# Altium schematic sheet obc-v2_EXP-CAN-RS422.SchDoc
size 420 x 297 mm; SheetNumber: 12; SheetTotal: 21
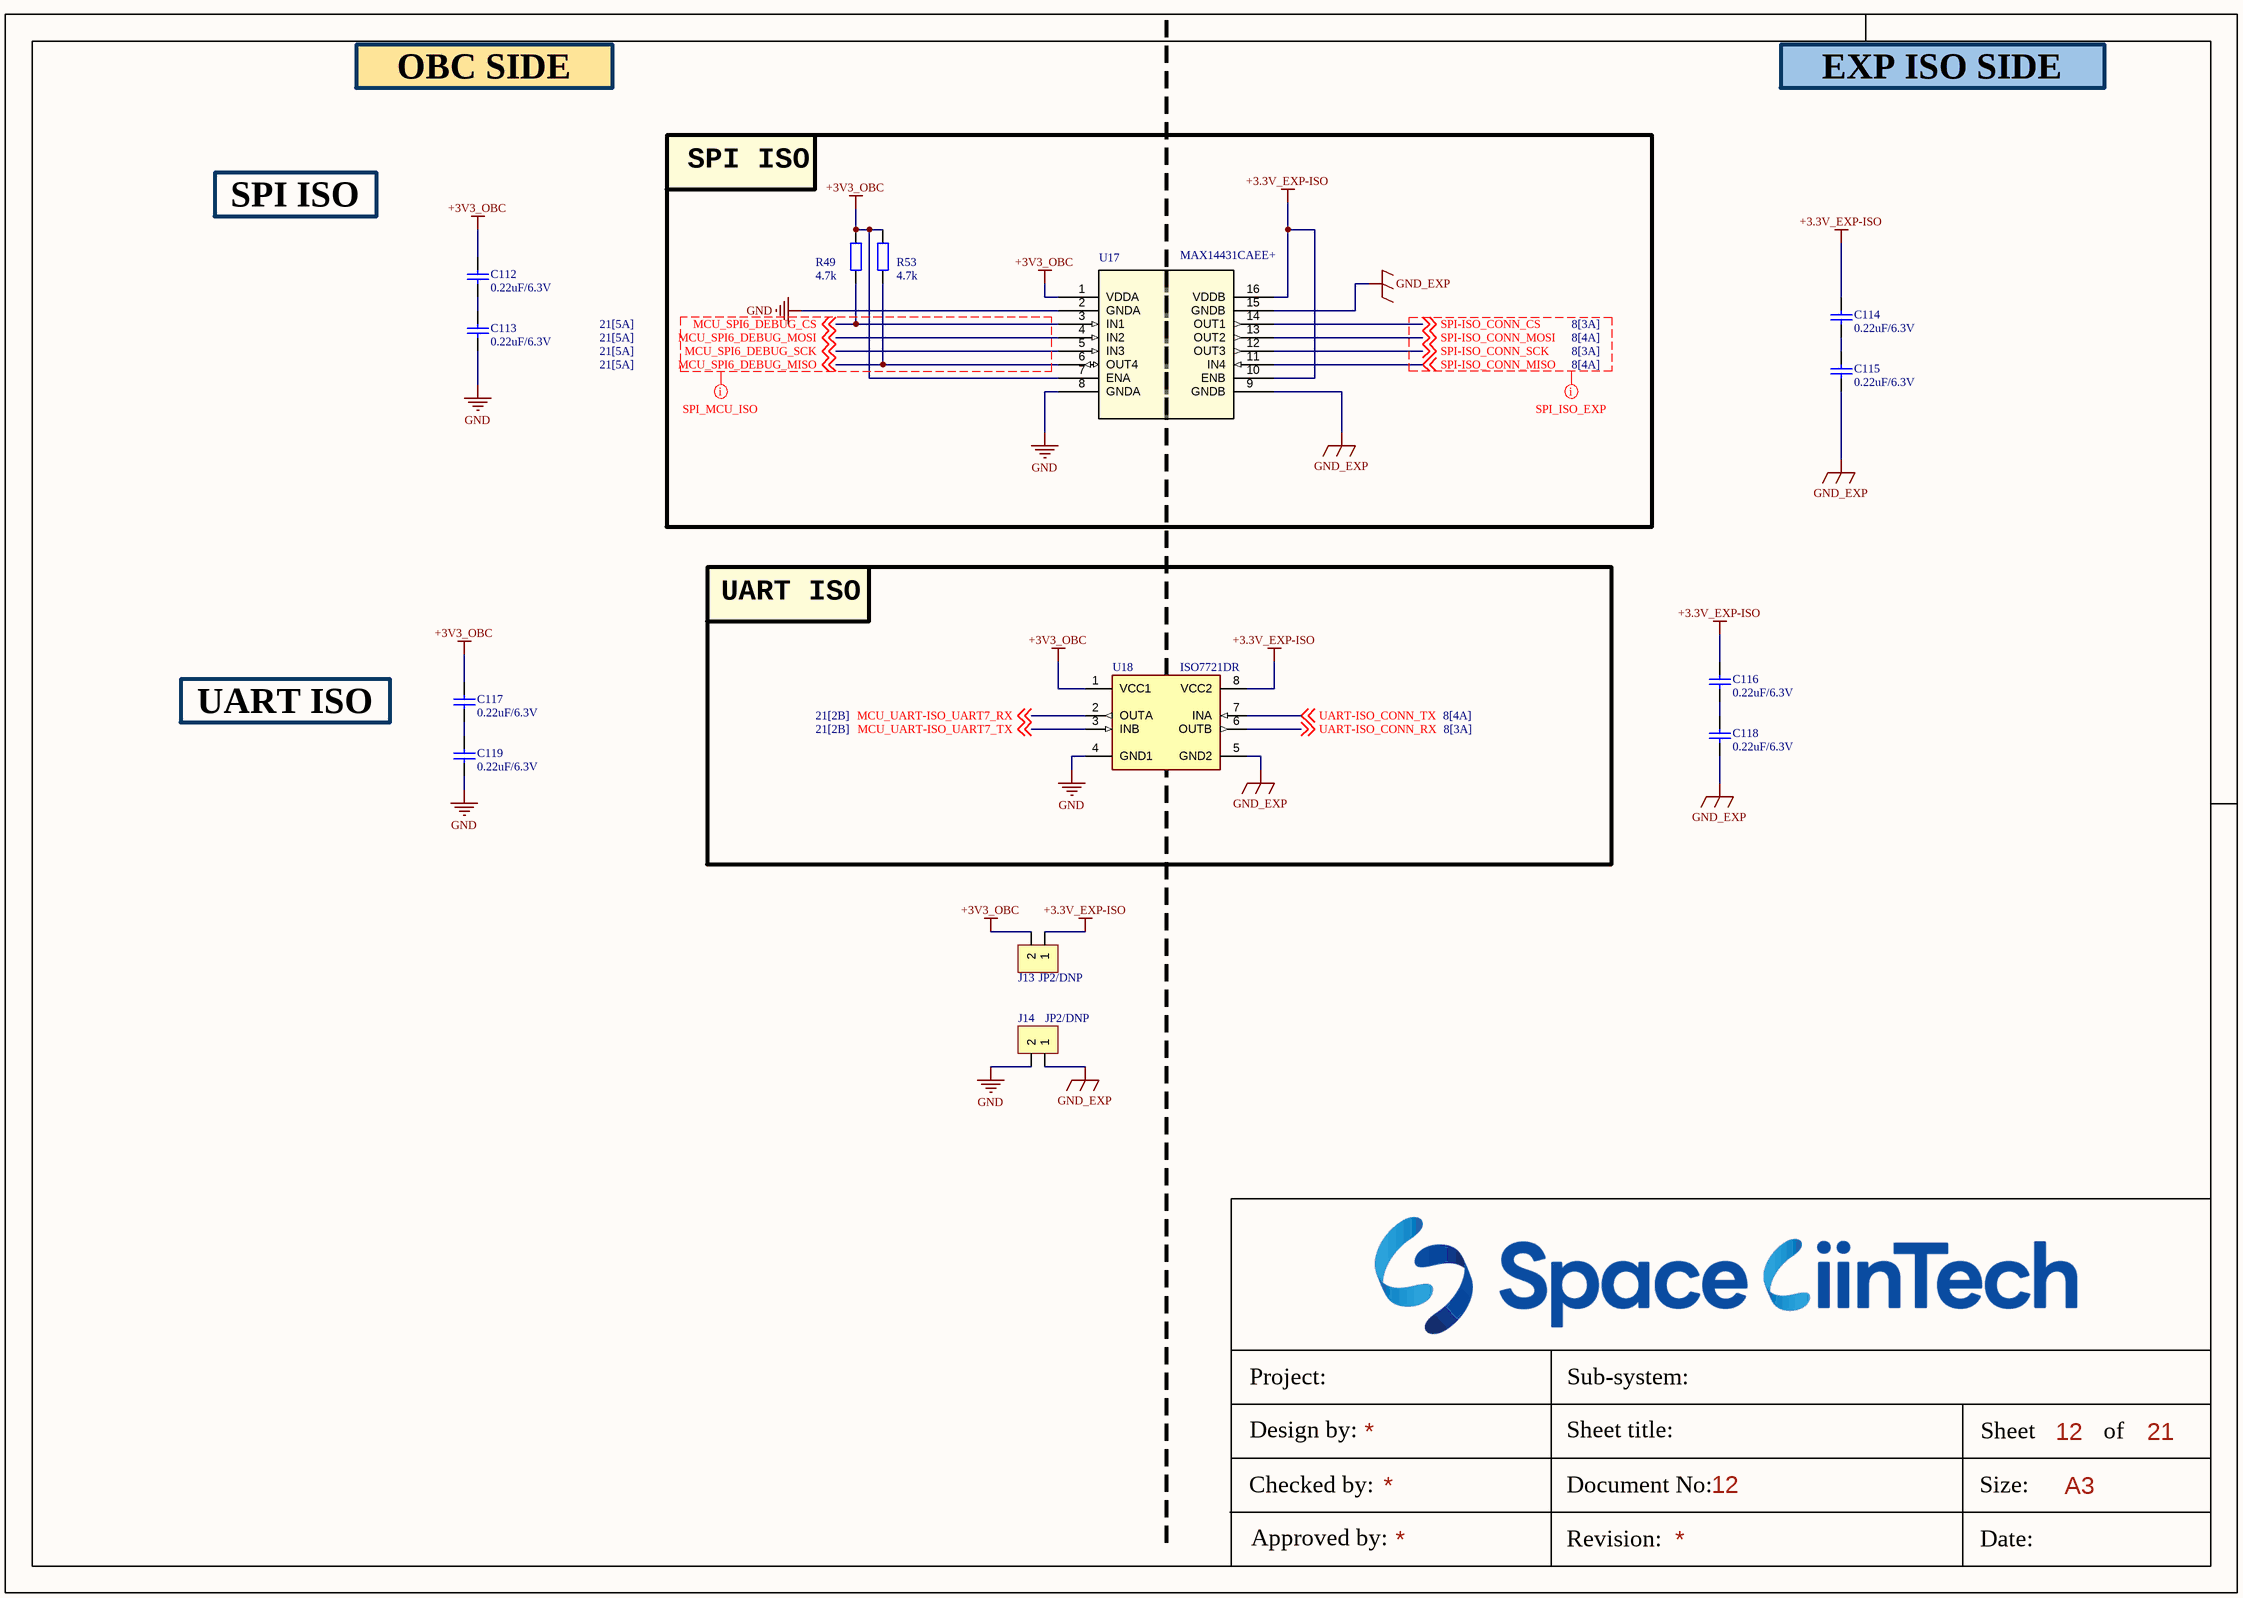
[diagram p0: obc-v2_EXP-CAN-RS422.SchDoc]

## Parts
C112  0.22uF/6.3V  [CAP_C_1005X60]
C113  0.22uF/6.3V  [CAP_C_1005X60]
C114  0.22uF/6.3V  [CAP_C_1005X60]
C115  0.22uF/6.3V  [CAP_C_1005X60]
C116  0.22uF/6.3V  [CAP_C_1005X60]
C117  0.22uF/6.3V  [CAP_C_1005X60]
C118  0.22uF/6.3V  [CAP_C_1005X60]
C119  0.22uF/6.3V  [CAP_C_1005X60]
J13  JP2/DNP  [JP2-D1T]
J14  JP2/DNP  [JP2-D1T]
R49  4.7k  [RES_C_1608X60]
R53  4.7k  [RES_C_1608X60]
U17  MAX14431CAEE+  [21-0055Q_E16MS+1F_MXM]
U18  ISO7721DR  [SOIC127P602X173-8N]

## Blocks framed on the sheet
SPI ISO: R49 R53 U17
UART ISO: U18

## Nets
+3.3V_EXP-ISO: C114.2 C116.2 J13.1 U17.10(ENB) U17.16(VDDB) U18.8(VCC2)
+3V3_OBC: C112.1 C117.1 J13.2 R49.2 R53.2 U17.1(VDDA) U17.7(ENA) U18.1(VCC1)
GND: C113.2 C119.2 J14.2 U17.2(GNDA) U17.8(GNDA) U18.4(GND1)
GND_EXP: C115.1 C118.1 J14.1 U17.9(GNDB) U17.15(GNDB) U18.5(GND2)
MCU_SPI6_DEBUG_CS: R49.1 U17.3(IN1) ; off-sheet MCU_SPI6_DEBUG_CS
MCU_SPI6_DEBUG_MISO: R53.1 U17.6(OUT4) ; off-sheet MCU_SPI6_DEBUG_MISO
MCU_SPI6_DEBUG_MOSI: U17.4(IN2) ; off-sheet MCU_SPI6_DEBUG_MOSI
MCU_SPI6_DEBUG_SCK: U17.5(IN3) ; off-sheet MCU_SPI6_DEBUG_SCK
MCU_UART-ISO_UART7_RX: U18.2(OUTA) ; off-sheet MCU_UART-ISO_UART7_RX
MCU_UART-ISO_UART7_TX: U18.3(INB) ; off-sheet MCU_UART-ISO_UART7_TX
SPI-ISO_CONN_CS: U17.14(OUT1) ; off-sheet SPI-ISO_CONN_CS
SPI-ISO_CONN_MISO: U17.11(IN4) ; off-sheet SPI-ISO_CONN_MISO
SPI-ISO_CONN_MOSI: U17.13(OUT2) ; off-sheet SPI-ISO_CONN_MOSI
SPI-ISO_CONN_SCK: U17.12(OUT3) ; off-sheet SPI-ISO_CONN_SCK
UART-ISO_CONN_RX: U18.6(OUTB) ; off-sheet UART-ISO_CONN_RX
UART-ISO_CONN_TX: U18.7(INA) ; off-sheet UART-ISO_CONN_TX
NetC112_2: C112.2 C113.1
NetC114_1: C114.1 C115.2
NetC116_1: C116.1 C118.2
NetC117_2: C117.2 C119.1

## Layout directives
net class SPI_MCU_ISO: MCU_SPI6_DEBUG_CS, MCU_SPI6_DEBUG_MISO, MCU_SPI6_DEBUG_MOSI, MCU_SPI6_DEBUG_SCK
net class SPI_ISO_EXP: SPI-ISO_CONN_CS, SPI-ISO_CONN_MISO, SPI-ISO_CONN_MOSI, SPI-ISO_CONN_SCK

## Notes on the sheet
- OBC SIDE
- EXP ISO SIDE
- SPI ISO
- UART ISO
- Project:
- Sub-system:
- Design by:
- Sheet title:
- Sheet
- A3
- of
- Checked by:
- Approved by:
- Revision:
- Document No:
- Size:
- Date:

## Library data of the parts
C112-C119 = Tu 0402 33nF 10V: CAPC; Chung_Loai: Dán; Don_Vi: Con; So_Chan: 2; Ten_Linh_Kien: Tụ 0402 33nF X7R 10V GRM155R71A333KA01D; Ma_Hang: MH007853; Kieu_Chan: *
J13 J14 = JP2: WR-PHD 2.54 mm Angled Socket Header; Manufacturer: W¨¹rth Elektronik eiSos GmbH; partNo: 613002143121; ComponentLink1 Description: Manufacturer; ComponentLink2 Description: Datasheet; NoPins: 02; Created Date: 29 March 2013; ComponentLink1URL: http://www.we-online.com; ComponentLink2URL: http://katalog.we-online.de/em/datasheet/6130xx143121.pdf; Created by: Karrer Zheng
R49 R53 = Tro 0603 1% 10k: RES; Chung_Loai: Dán; Don_Vi: Con; So_Chan: 2; Ten_Linh_Kien: Trở 0603 1% 10k; Ma_Hang: MH006333; Kieu_Chan: *
U17 = MAX14431CAEE+: No Description Available; Mfr_Name: Analog Devices / Maxim Integrated; RefDes: RefDes; Type: Type
U18 = ISO7721DR: Robust EMC, dual-channel, 1/1, reinforced digital isolator 8-SOIC -55 to 125; Package: None; Value: *; MP: ISO7721DR; Availability: Unavailable; Price: None